# EAGLE design sensor-mega169a (EAGLE 6.4)
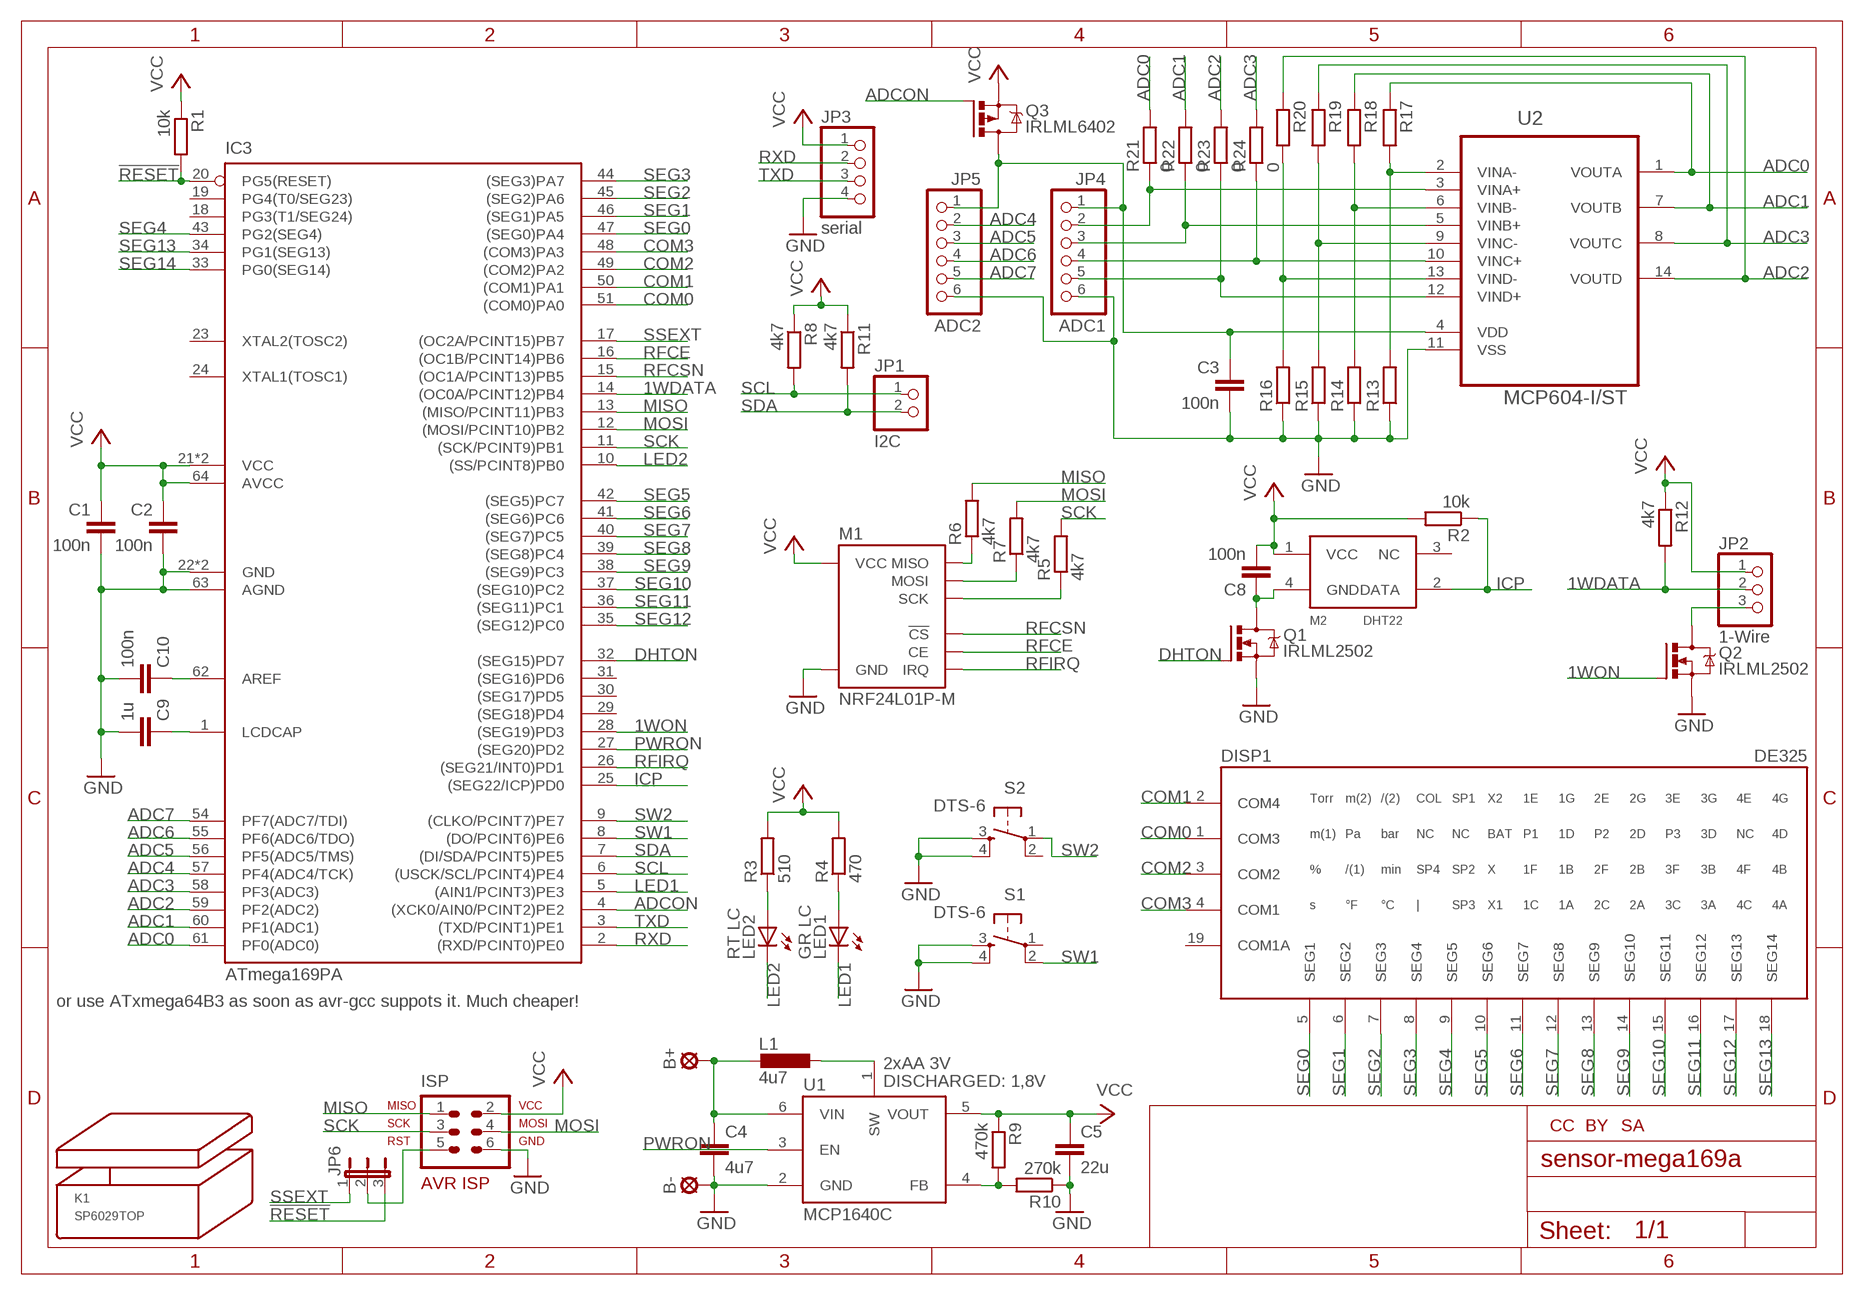
[diagram p0: schematic, sheet 1]

## Parts
B+  LSP11  [LSP11]
B-  LSP11  [LSP11]
C1  100n  C-EUC0603  [C0603]
C2  100n  C-EUC0603  [C0603]
C3  100n  C-EUC0603  [C0603]
C4  4u7  C-EUC0805  [C0805]
C5  22u  C-EUC1206  [C1206]
C8  100n  C-EUC0603  [C0603]
C9  1u  C-EUC0603  [C0603]
C10  100n  C-EUC0603  [C0603]
DISP1  DE325  [DE325]
IC3  ATmega169PA  MEGA169-A  [TQFP64]
ISP  ML6  AVR-ISP-6VERT  [AVR-ISP-6]
JP1  I2C  PINHD-1X2_2.54  [1X02]
JP2  1-Wire  PINHD-1X3_2.54  [1X03]
JP3  serial  PINHD-1X4_2.54  [1X04]
JP4  ADC1  PINHD-1X6_2.54  [1X06]
JP5  ADC2  PINHD-1X6_2.54  [1X06]
JP6  JP2E  [JP2]
K1  SP6029TOP  [SP6029T]
L1  4u7  L-EUPISG  [PISG]
LED1  GR LC  LED5MM  [LED5MM]
LED2  RT LC  LED5MM  [LED5MM]
M1  NRF24L01P-M  [NRF24L01P-A]
M2  DHT22  [DHT22]
Q1  IRLML2502  [MICRO3]
Q2  IRLML2502  [MICRO3]
Q3  IRLML6402  [MICRO3]
R1  10k  R-EU_R0603  [R0603]
R2  10k  R-EU_R0603  [R0603]
R3  510  R-EU_R0805  [R0805]
R4  470  R-EU_R0805  [R0805]
R5  4k7  R-EU_R0603  [R0603]
R6  4k7  R-EU_R0603  [R0603]
R7  4k7  R-EU_R0603  [R0603]
R8  4k7  R-EU_R0603  [R0603]
R9  470k  R-EU_R0603  [R0603]
R10  270k  R-EU_R0603  [R0603]
R11  4k7  R-EU_R0603  [R0603]
R12  4k7  R-EU_R0603  [R0603]
R13  R-EU_R0603  [R0603]
R14  R-EU_R0603  [R0603]
R15  R-EU_R0603  [R0603]
R16  R-EU_R0603  [R0603]
R17  R-EU_R0603  [R0603]
R18  R-EU_R0603  [R0603]
R19  R-EU_R0603  [R0603]
R20  R-EU_R0603  [R0603]
R21  0  R-EU_R0201  [R0201]
R22  0  R-EU_R0201  [R0201]
R23  0  R-EU_R0201  [R0201]
R24  0  R-EU_R0201  [R0201]
S1  DTS-6  [DTS-6]
S2  DTS-6  [DTS-6]
U1  MCP1640C  MCP1640  [SOT23-6]
U2  MCP604-I/ST  [SOP65P640X120-14N]
U$1  CC-TPLACE-HALF  [CC_TPLACE_HS]
U$3  BY-TPLACE-HS  [BY_TPLACE_HS]
U$4  SA-TPLACE-HALF  [SA_TPLACE_HS]

## Nets
1WDATA: IC3.14((OC0A/PCINT12)PB4) JP2.2 R12.2
1WON: IC3.28((SEG19)PD3) Q2.1(G)
!RESET: IC3.20(PG5(RESET)) JP6.3 R1.2
ADC0: IC3.61(PF0(ADC0)) R17.1 R21.2 U2.1(VOUTA)
ADC1: IC3.60(PF1(ADC1)) R18.1 R22.2 U2.7(VOUTB)
ADC2: IC3.59(PF2(ADC2)) R20.1 R23.2 U2.14(VOUTD)
ADC3: IC3.58(PF3(ADC3)) R19.1 R24.2 U2.8(VOUTC)
ADC4: IC3.57(PF4(ADC4/TCK)) JP5.2
ADC5: IC3.56(PF5(ADC5/TMS)) JP5.3
ADC6: IC3.55(PF6(ADC6/TDO)) JP5.4
ADC7: IC3.54(PF7(ADC7/TDI)) JP5.5
ADCON: IC3.4((XCK0/AIN0/PCINT2)PE2) Q3.1(G)
AREF: C10.1 IC3.62(AREF)
COM0: DISP1.1(COM3) IC3.51((COM0)PA0)
COM1: DISP1.2(COM4) IC3.50((COM1)PA1)
COM2: DISP1.3(COM2) IC3.49((COM2)PA2)
COM3: DISP1.4(COM1) IC3.48((COM3)PA3)
DHTON: IC3.32((SEG15)PD7) Q1.1(G)
GND: B-.MP C1.2 C2.2 C3.2 C4.2 C5.2 C9.2 C10.2 IC3.22(GND) IC3.53(GND) IC3.63(AGND) ISP.6 JP3.4 JP4.6 JP5.6 M1.GND_A(GND) M1.GND_B(GND) Q1.2(S) Q2.2(S) R10.1 R13.1 R14.1 R15.1 R16.1 S1.3 S1.4 S2.3 S2.4 U1.2(GND) U2.11(VSS)
ICP: IC3.25((SEG22/ICP)PD0) M2.2(DATA) R2.1
LCDCAP: C9.1 IC3.1(LCDCAP)
LED1: IC3.5((AIN1/PCINT3)PE3) LED1.K(C)
LED2: IC3.10((SS/PCINT8)PB0) LED2.K(C)
MISO: IC3.13((MISO/PCINT11)PB3) ISP.1 R6.2
MOSI: IC3.12((MOSI/PCINT10)PB2) ISP.4 R7.2
N$1: LED2.A R3.1
N$2: C8.1 M2.4(GND) Q1.3(D)
N$3: M1.MISO R6.1
N$4: M1.MOSI R7.1
N$5: M1.SCK R5.1
N$6: ISP.5 JP6.2
N$7: L1.1 U1.1(SW)
N$8: R9.2 R10.2 U1.4(FB)
N$11: JP2.3 Q2.3(D)
N$13: LED1.A R4.1
N$16: JP4.2 R21.1 U2.3(VINA+)
N$17: C3.1 JP4.1 JP5.1 Q3.3(D) U2.4(VDD)
N$18: R16.2 R20.2 U2.13(VIND-)
N$19: R15.2 R19.2 U2.9(VINC-)
N$20: R14.2 R18.2 U2.6(VINB-)
N$21: R13.2 R17.2 U2.2(VINA-)
N$22: JP4.3 R22.1 U2.5(VINB+)
N$24: JP4.5 R23.1 U2.12(VIND+)
N$27: JP4.4 R24.1 U2.10(VINC+)
PWRON: IC3.27((SEG20)PD2) U1.3(EN)
RFCE: IC3.16((OC1B/PCINT14)PB6) M1.CE
RFCSN: IC3.15((OC1A/PCINT13)PB5) M1.CSN(!CS)
RFIRQ: IC3.26((SEG21/INT0)PD1) M1.IRQ
RXD: IC3.2((RXD/PCINT0)PE0) JP3.2
SCK: IC3.11((SCK/PCINT9)PB1) ISP.3 R5.2
SCL: IC3.6((USCK/SCL/PCINT4)PE4) JP1.1 R8.2
SDA: IC3.7((DI/SDA/PCINT5)PE5) JP1.2 R11.2
SEG0: DISP1.5(SEG1) IC3.47((SEG0)PA4)
SEG1: DISP1.6(SEG2) IC3.46((SEG1)PA5)
SEG2: DISP1.7(SEG3) IC3.45((SEG2)PA6)
SEG3: DISP1.8(SEG4) IC3.44((SEG3)PA7)
SEG4: DISP1.9(SEG5) IC3.43(PG2(SEG4))
SEG5: DISP1.10(SEG6) IC3.42((SEG5)PC7)
SEG6: DISP1.11(SEG7) IC3.41((SEG6)PC6)
SEG7: DISP1.12(SEG8) IC3.40((SEG7)PC5)
SEG8: DISP1.13(SEG9) IC3.39((SEG8)PC4)
SEG9: DISP1.14(SEG10) IC3.38((SEG9)PC3)
SEG10: DISP1.15(SEG11) IC3.37((SEG10)PC2)
SEG11: DISP1.16(SEG12) IC3.36((SEG11)PC1)
SEG12: DISP1.17(SEG13) IC3.35((SEG12)PC0)
SEG13: DISP1.18(SEG14) IC3.34(PG1(SEG13))
SEG14: IC3.33(PG0(SEG14))
SSEXT: IC3.17((OC2A/PCINT15)PB7) JP6.1
SW1: IC3.8((DO/PCINT6)PE6) S1.2
SW2: IC3.9((CLKO/PCINT7)PE7) S2.1
TXD: IC3.3((TXD/PCINT1)PE1) JP3.3
VBAT: B+.MP C4.1 L1.2 U1.6(VIN)
VCC: C1.1 C2.1 C5.1 C8.2 IC3.21(VCC) IC3.52(VCC) IC3.64(AVCC) ISP.2 JP2.1 JP3.1 M1.VCC_A(VCC) M1.VCC_B(VCC) M2.1(VCC) Q3.2(S) R1.1 R2.2 R3.2 R4.2 R8.1 R9.1 R11.1 R12.1 U1.5(VOUT)
Unconnected: DISP1.19(COM1A) IC3.18(PG3(T1/SEG24)) IC3.19(PG4(T0/SEG23)) IC3.23(XTAL2(TOSC2)) IC3.24(XTAL1(TOSC1)) IC3.29((SEG18)PD4) IC3.30((SEG17)PD5) IC3.31((SEG16)PD6) M2.3(NC) S1.1 S2.2

## Notes on the sheet
- or use ATxmega64B3 as soon as avr-gcc suppots it. Much cheaper!
- 2xAA 3V
- DISCHARGED: 1,8V

## Library data of the parts
B+ B- = solpad:LSP11: SOLDER PAD drill 1.1 mm
C1-C3 C8-C10 = rcl:C-EU: CAPACITOR, European symbol
C4 = rcl:C-EU: CAPACITOR, European symbol; _REICHELT_: X7R-G0805 4,7/16
C5 = rcl:C-EU: CAPACITOR, European symbol; _REICHELT_: X7R-G1206 22/10
DISP1 = lcd_displays:DE325: Display Elektronik GmbH DE325-Series Datasheet: http://display-elektronik.de/DE325-RS-20_843V.PDF
IC3 = avr-7:MEGA169: MICROCONTROLLER 16 Kbytes FLASH 1 Kbytes SRAM 512 bytes EEPROM USART 8-channel 10 bit ADC 4x25 Segment LCD Driver
ISP = avr-7:AVR-ISP-6: AVR ISP-6 Serial Programming Header
JP1 = pinhead-mod:PINHD-1X2: PIN HEADER
JP2 = pinhead-mod:PINHD-1X3: PIN HEADER
JP3 = pinhead-mod:PINHD-1X4: PIN HEADER
JP4 JP5 = pinhead-mod:PINHD-1X6: PIN HEADER
JP6 = jumper:JP2E: JUMPER
K1 = strapubox:SP6029: Gehäuse Strapubox Typ 6029 Montage Deckel max. Bauteilhöhe, top-layer: 7,5 mm max. Bauteilhöhe, bottom-layer: 10 mm (Dicke der LP: 1,5 mm) Montage Boden max. Bauteilhöhe, top-layer: 12,5 mm max. Bauteilhöhe, bottom-layer: 5 mm (Dicke der LP: 1,5 mm) Außenmaße: Länge: 80 mm Breite: 61 mm Höhe: 23 mm Innenmaße: Länge: 75 mm Breite: 56 mm Höhe: 19 mm Mit Batteriefach 2xAA/9V
L1 = inductor-Fastron:L-EU; _REICHELT_: L-PISG 4,7µ
LED1 = led:LED: LED OSRAM: - CHIPLED LG R971, LG N971, LY N971, LG Q971, LY Q971, LO R971, LY R971 LH N974, LH R974 LS Q976, LO Q976, LY Q976 LO Q996 - Hyper CHIPLED LW Q18S LB Q993, LB Q99A, LB R99A - SideLED LS A670, LO A670, LY A670, LG A670, LP A670 LB A673, LV A673, LT A673, LW A673 LH A674 LY A675 LS A676, LA A676, LO A676, LY A676, LW A676 LS A679, LY A679, LG A679 - Hyper Micro SIDELED® LS Y876, LA Y876, LO Y876, LY Y876 LT Y87S - SmartLED LW L88C, LW L88S LB L89C, LB L89S, LG L890 LS L89K, LO L89K, LY L89K LS L896, LA L896, LO L896, LY L896 - TOPLED LS T670, LO T670, LY T670, LG T670, LP T670 LSG T670, LSP T670, LSY T670, LOP T670, LYG T670 LG T671, LOG T671, LSG T671 LB T673, LV T673, LT T673, LW T673 LH T674 LS T676, LA T676, LO T676, LY T676, LB T676, LH T676, LSB T676, LW T676 LB T67C, LV T67C, LT T67C, LS T67K, LO T67K, LY T67K, LW E67C LS E67B, LA E67B, LO E67B, LY E67B, LB E67C, LV E67C, LT E67C LW T67C LS T679, LY T679, LG T679 LS T770, LO T770, LY T770, LG T770, LP T770 LB T773, LV T773, LT T773, LW T773 LH T774 LS E675, LA E675, LY E675, LS T675 LS T776, LA T776, LO T776, LY T776, LB T776 LHGB T686 LT T68C, LB T68C - Hyper Mini TOPLED® LB M676 - Mini TOPLED Santana® LG M470 LS M47K, LO M47K, LY M47K Source: http://www.osram.convergy.de LUXEON: - LUMILED® LXK2-PW12-R00, LXK2-PW12-S00, LXK2-PW14-U00, LXK2-PW14-V00 LXK2-PM12-R00, LXK2-PM12-S00, LXK2-PM14-U00 LXK2-PE12-Q00, LXK2-PE12-R00, LXK2-PE12-S00, LXK2-PE14-T00, LXK2-PE14-U00 LXK2-PB12-K00, LXK2-PB12-L00, LXK2-PB12-M00, LXK2-PB14-N00, LXK2-PB14-P00, LXK2-PB14-Q00 LXK2-PR12-L00, LXK2-PR12-M00, LXK2-PR14-Q00, LXK2-PR14-R00 LXK2-PD12-Q00, LXK2-PD12-R00, LXK2-PD12-S00 LXK2-PH12-R00, LXK2-PH12-S00 LXK2-PL12-P00, LXK2-PL12-Q00, LXK2-PL12-R00 Source: www.luxeon.com KINGBRIGHT: KA-3528ASYC Source: www.kingbright.com; I: 2.2mA; U_F: 2V2
LED2 = led:LED: LED OSRAM: - CHIPLED LG R971, LG N971, LY N971, LG Q971, LY Q971, LO R971, LY R971 LH N974, LH R974 LS Q976, LO Q976, LY Q976 LO Q996 - Hyper CHIPLED LW Q18S LB Q993, LB Q99A, LB R99A - SideLED LS A670, LO A670, LY A670, LG A670, LP A670 LB A673, LV A673, LT A673, LW A673 LH A674 LY A675 LS A676, LA A676, LO A676, LY A676, LW A676 LS A679, LY A679, LG A679 - Hyper Micro SIDELED® LS Y876, LA Y876, LO Y876, LY Y876 LT Y87S - SmartLED LW L88C, LW L88S LB L89C, LB L89S, LG L890 LS L89K, LO L89K, LY L89K LS L896, LA L896, LO L896, LY L896 - TOPLED LS T670, LO T670, LY T670, LG T670, LP T670 LSG T670, LSP T670, LSY T670, LOP T670, LYG T670 LG T671, LOG T671, LSG T671 LB T673, LV T673, LT T673, LW T673 LH T674 LS T676, LA T676, LO T676, LY T676, LB T676, LH T676, LSB T676, LW T676 LB T67C, LV T67C, LT T67C, LS T67K, LO T67K, LY T67K, LW E67C LS E67B, LA E67B, LO E67B, LY E67B, LB E67C, LV E67C, LT E67C LW T67C LS T679, LY T679, LG T679 LS T770, LO T770, LY T770, LG T770, LP T770 LB T773, LV T773, LT T773, LW T773 LH T774 LS E675, LA E675, LY E675, LS T675 LS T776, LA T776, LO T776, LY T776, LB T776 LHGB T686 LT T68C, LB T68C - Hyper Mini TOPLED® LB M676 - Mini TOPLED Santana® LG M470 LS M47K, LO M47K, LY M47K Source: http://www.osram.convergy.de LUXEON: - LUMILED® LXK2-PW12-R00, LXK2-PW12-S00, LXK2-PW14-U00, LXK2-PW14-V00 LXK2-PM12-R00, LXK2-PM12-S00, LXK2-PM14-U00 LXK2-PE12-Q00, LXK2-PE12-R00, LXK2-PE12-S00, LXK2-PE14-T00, LXK2-PE14-U00 LXK2-PB12-K00, LXK2-PB12-L00, LXK2-PB12-M00, LXK2-PB14-N00, LXK2-PB14-P00, LXK2-PB14-Q00 LXK2-PR12-L00, LXK2-PR12-M00, LXK2-PR14-Q00, LXK2-PR14-R00 LXK2-PD12-Q00, LXK2-PD12-R00, LXK2-PD12-S00 LXK2-PH12-R00, LXK2-PH12-S00 LXK2-PL12-P00, LXK2-PL12-Q00, LXK2-PL12-R00 Source: www.luxeon.com KINGBRIGHT: KA-3528ASYC Source: www.kingbright.com; I: 2mA; U_F: 2V
M1 = modules:NRF24L01P-M
M2 = modules:DHT22
Q1 Q2 = mosfet:IRLML2502: HEXFET N-Channel Power MOSFET http://www.irf.com/product-info/datasheets/data/irlml2502.pdf
Q3 = mosfet:IRLML6402: HEXFET P-Channel Power MOSFET http://www.irf.com/product-info/datasheets/data/irlml6402.pdf
R1-R24 = rcl:R-EU_: RESISTOR, European symbol
S1 S2 = switch-tact:DTS-6
U1 = karlnet-parts:MCP1640: MCP1623, 1624, 1640/B/C/D pwm/pfm or pwm only DC/DC converters, in SOT-23
U2 = microchip:MCP604-I/ST: IC,OPAMP,QUAD; MPN: MCP604-I/ST; OC_FARNELL: 1825060; OC_NEWARK: 12T7762; PACKAGE: TSSOP14; SUPPLIER: Microchip
U$1 = creative-commons:CC: creatice commons - CC
U$3 = creative-commons:BY: creative commons Attribution - BY
U$4 = creative-commons:SA: creative commons ShareAlike - SA

## Board
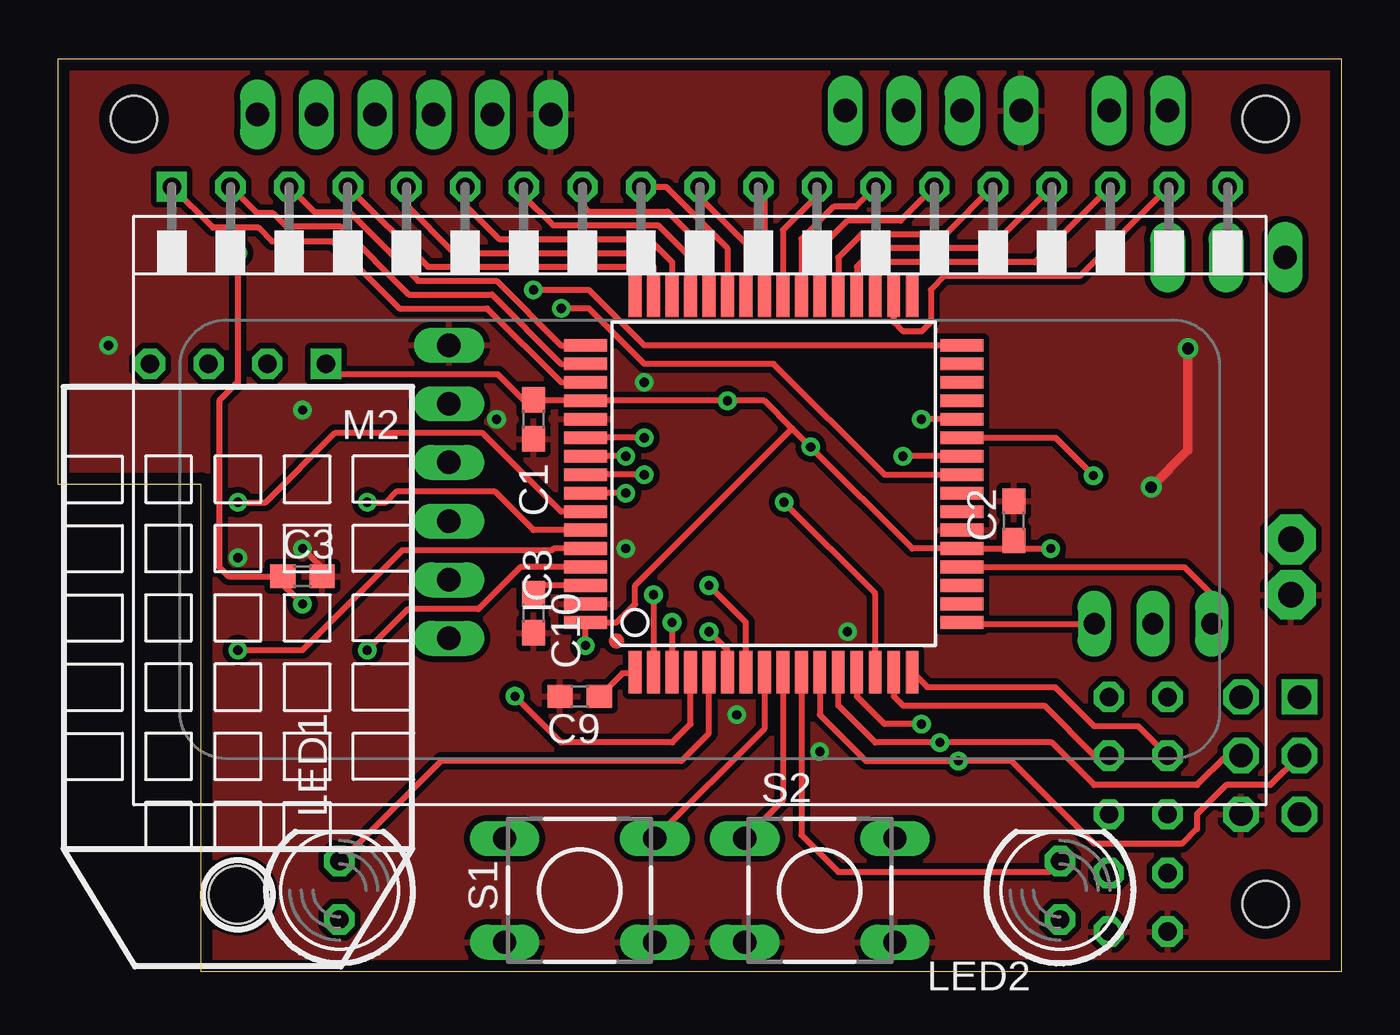
[diagram p1: board, top side]
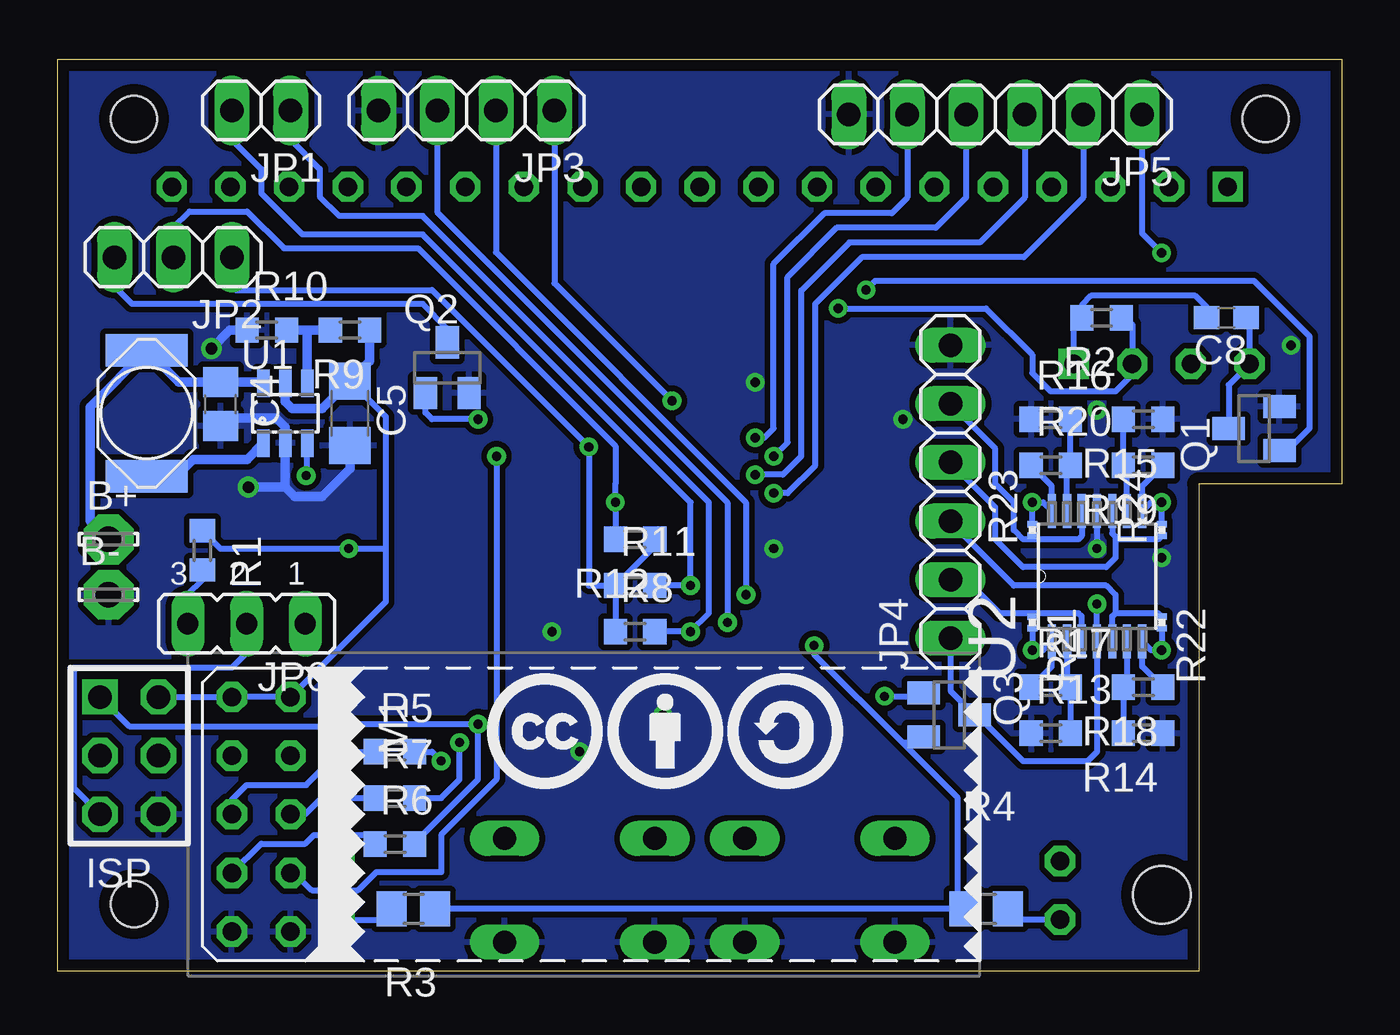
[diagram p2: board, bottom side, seen from below]

Size 55.6 x 39.5 mm. Coordinates in mm from the lower left corner, seen from the top.
Outline: 6.2,21.1 6.2,0 55.6,0 55.6,39.5 0,39.5 0,21.1 6.2,21.1
Copper layers (1*16): Top 0.035mm / dielectric 1.5mm / Bottom 0.035mm
Design rules "bilex-cust *": minimum track width 10mil, minimum drill 0.4mm, track to track 10mil, track to pad 10mil, pad to pad 10mil, via to via 10mil, smd to smd 10mil, copper to edge 0.5mm, drill to drill 8mil, minimum pad ring 10mil, minimum via ring 8mil, stop-mask expansion 4mil, vias tented up to drill 0mil, thermal gap 10mil
Holes 2 mm at 52.3,2.9 52.3,36.9 3.3,36.9
Holes 2.5 mm at 7.8,3.3
bKeepout: area 24.3,24 to 31.6,31.4; area 26.3,30.9 to 29.3,36.9; area 24.3,32.6 to 31.5,39.8

### Footprints (pad centres in the part's own frame; a part is rotated, then mirrored left to right if it is on the bottom)
LSP11 = drill 1.118 pad 2.159 octagon: MP 0,0
C0603 = smd 1.1 x 1: 1 -0.85,0; 2 0.85,0
C0805 = smd 1.3 x 1.5: 1 -0.95,0; 2 0.95,0
C1206 = smd 1.6 x 1.8: 1 -1.4,0; 2 1.4,0
DE325 = drill 0.8 square: 1 -22.86,1.27 | drill 0.8 octagon: 2 -20.32,1.27; 3 -17.78,1.27; 4 -15.24,1.27; 5 -12.7,1.27; 6 -10.16,1.27; 7 -7.62,1.27; 8 -5.08,1.27; 9 -2.54,1.27; 10 0,1.27; 11 2.54,1.27; 12 5.08,1.27; 13 7.62,1.27; 14 10.16,1.27; 15 12.7,1.27; 16 15.24,1.27; 17 17.78,1.27; 18 20.32,1.27; 19 22.86,1.27
TQFP64 = smd 1.85 x 0.55: 1 -8.15,6; 2 -8.15,5.2; 3 -8.15,4.4; 4 -8.15,3.6; 5 -8.15,2.8; 6 -8.15,2; 7 -8.15,1.2; 8 -8.15,0.4; 9 -8.15,-0.4; 10 -8.15,-1.2; 11 -8.15,-2; 12 -8.15,-2.8; 13 -8.15,-3.6; 14 -8.15,-4.4; 15 -8.15,-5.2; 16 -8.15,-6; 33 8.15,-6; 34 8.15,-5.2; 35 8.15,-4.4; 36 8.15,-3.6; 37 8.15,-2.8; 38 8.15,-2; 39 8.15,-1.2; 40 8.15,-0.4; 41 8.15,0.4; 42 8.15,1.2; 43 8.15,2; 44 8.15,2.8; 45 8.15,3.6; 46 8.15,4.4; 47 8.15,5.2; 48 8.15,6 | smd 0.55 x 1.85: 17 -6,-8.15; 18 -5.2,-8.15; 19 -4.4,-8.15; 20 -3.6,-8.15; 21 -2.8,-8.15; 22 -2,-8.15; 23 -1.2,-8.15; 24 -0.4,-8.15; 25 0.4,-8.15; 26 1.2,-8.15; 27 2,-8.15; 28 2.8,-8.15; 29 3.6,-8.15; 30 4.4,-8.15; 31 5.2,-8.15; 32 6,-8.15; 49 6,8.15; 50 5.2,8.15; 51 4.4,8.15; 52 3.6,8.15; 53 2.8,8.15; 54 2,8.15; 55 1.2,8.15; 56 0.4,8.15; 57 -0.4,8.15; 58 -1.2,8.15; 59 -2,8.15; 60 -2.8,8.15; 61 -3.6,8.15; 62 -4.4,8.15; 63 -5.2,8.15; 64 -6,8.15
AVR-ISP-6 = drill 1.016 square: 1 -2.54,-1.27 | drill 1.016 octagon: 2 -2.54,1.27; 3 0,-1.27; 4 0,1.27; 5 2.54,-1.27; 6 2.54,1.27
1X02 = drill 1.016 long: 1 -1.27,0; 2 1.27,0
1X03 = drill 1.016 long: 1 -2.54,0; 2 0,0; 3 2.54,0
1X04 = drill 1.016 long: 1 -3.81,0; 2 -1.27,0; 3 1.27,0; 4 3.81,0
1X06 = drill 1.016 long: 1 -6.35,0; 2 -3.81,0; 3 -1.27,0; 4 1.27,0; 5 3.81,0; 6 6.35,0
JP2 = drill 0.914 long: 1 -2.54,0; 2 0,0; 3 2.54,0
PISG = smd 1.4 x 3.56: 1 -2.73,0; 2 2.73,0
LED5MM = drill 0.813 octagon: A -1.27,0; K 1.27,0
NRF24L01P-A = drill 0.8 octagon: CE -2.54,-1.27; CSN -2.54,1.27; GND_A 5.08,1.27; GND_B 5.08,-1.27; IRQ 2.54,1.27; MISO 2.54,-1.27; MOSI 0,1.27; SCK 0,-1.27; VCC_A -5.08,1.27; VCC_B -5.08,-1.27
DHT22 = drill 0.8 square: 1 -3.81,0 | drill 0.8 octagon: 2 -1.27,0; 3 1.27,0; 4 3.81,0
MICRO3 = smd 1 x 1.4: 1 -0.95,-1.1; 2 0.95,-1.1; 3 0,1.1
R0603 = smd 1 x 1.1: 1 -0.85,0; 2 0.85,0
R0805 = smd 1.3 x 1.5: 1 -0.95,0; 2 0.95,0
R0201 = smd 0.28 x 0.43: 1 -0.255,0; 2 0.255,0
DTS-6 = drill 1 long: 1 -3.25,2.25; 2 3.25,2.25; 3 -3.25,-2.25; 4 3.25,-2.25
SOT23-6 = smd 0.55 x 1.2: 1 -0.95,-1.3; 2 0,-1.3; 3 0.95,-1.3; 4 0.95,1.3; 5 0,1.3; 6 -0.95,1.3
SOP65P640X120-14N = smd 1.473 x 0.356: 1 -2.819,1.956; 2 -2.819,1.295; 3 -2.819,0.66; 4 -2.819,0; 5 -2.819,-0.66; 6 -2.819,-1.295; 7 -2.819,-1.956; 8 2.819,-1.956; 9 2.819,-1.295; 10 2.819,-0.66; 11 2.819,0; 12 2.819,0.66; 13 2.819,1.295; 14 2.819,1.956

### Placement (x,y rotation side)
B+  53.4,18.7 180 bottom
B-  53.4,16.3 0 bottom
C1  20.6,23.9 270 top
C2  41.4,19.5 90 top
C3  10.6,17.1 0 top
C4  48.54,24.56 270 bottom
C5  42.95,24.16 270 bottom
C8  5,28.3 180 bottom
C9  22.6,11.9 180 top
C10  20.6,15.5 270 top
DISP1  27.8,32.7 0 top
IC3  31,21.1 90 top
ISP  52.5,9.33 270 bottom
JP1  46.79,37.27 180 bottom
JP2  50.6,30.92 180 bottom
JP3  37.9,37.27 180 bottom
JP4  16.95,20.76 90 bottom
JP5  15,37.1 180 bottom
JP6  47.42,15.04 180 bottom
K1  -0.2,-2.1 0 top
L1  51.74,24.16 90 bottom
LED1  12.2,3.5 90 top
LED2  43.4,3.5 90 top
M1  46.79,6.79 270 bottom
M2  7.8,26.3 180 top
Q1  3.8,23.5 90 bottom
Q2  38.73,26.13 0 bottom
Q3  17,11.1 270 bottom
R1  49.33,18.22 270 bottom
R2  10.4,28.3 180 bottom
R3  40.2,2.7 0 bottom
R4  15.4,2.7 180 bottom
R5  41,9.5 0 bottom
R6  41,5.5 0 bottom
R7  41,7.5 0 bottom
R8  30.6,14.7 0 bottom
R9  42.95,27.76 180 bottom
R10  46.54,27.76 0 bottom
R11  30.6,16.7 0 bottom
R12  30.6,18.7 180 bottom
R13  12.6,10.3 0 bottom
R14  8.6,10.3 180 bottom
R15  8.6,23.9 180 bottom
R16  12.6,23.9 0 bottom
R17  12.6,12.3 0 bottom
R18  8.6,12.3 180 bottom
R19  8.6,21.9 180 bottom
R20  12.6,21.9 0 bottom
R21  13.4,15.1 270 bottom
R22  7.8,15.1 270 bottom
R23  13.4,19.1 90 bottom
R24  7.8,19.1 90 bottom
S1  22.6,3.5 0 top
S2  33,3.5 0 top
U1  45.74,24.16 0 bottom
U2  10.6,17.1 90 bottom
U$1  37,7.9 0 bottom
U$3  31.8,7.9 0 bottom
U$4  26.6,7.9 0 bottom

### Tracks (layer width: path | path; a pad name or v marks a point on that pad's centre or on a via)
1WDATA  (via drill 0.4)
  Top 0.254: IC3.14 35.4,16.35 v31.45,20.3
  Bottom 0.254: JP2.2 50.6,32.19 49.89,32.9 47.4,32.9 45.8,31.3 40,31.3 31.45,22.75 31.45,21.1 v31.45,20.3 R12.2
1WON  (via drill 0.4)
  Top 0.254: IC3.28 v37.4,23.9
  Bottom 0.254: v37.4,23.9 39.4,23.9 39.68,24.18 Q2.1
!RESET
  Top 0.254: IC3.20 48.78,17.5 49.96,16.31 JP6.3
  Bottom 0.254: JP6.3 49.96,16.31 49.33,16.95 R1.2
ADC0  (via drill 0.4)
  Top 0.254: IC3.61 20.04,17.5 18.21,15.68 15.18,15.68 v13.4,13.9
  Bottom 0.254: U2.1 12.94,13.9 v13.4,13.9 R21.2 | 12.56,14.4 U2.1 | R17.1 12.56,13.19 U2.1
ADC1  (via drill 0.4)
  Top 0.254: v7.8,13.9 10.6,13.9 14.92,18.22 21.39,18.22 21.47,18.3 IC3.60
  Bottom 0.254: U2.7 8.26,13.9 v7.8,13.9 R22.2 | 8.64,14.4 U2.7 | R18.1 8.64,13.19 U2.7
ADC2  (via drill 0.4)
  Top 0.254: IC3.59 20.6,19.1 18.94,20.76 14.66,20.76 14.2,20.3 v13.4,20.3
  Bottom 0.254: U2.14 12.62,19.92 | U2.14 12.94,20.3 v13.4,20.3 R23.2 | 12.56,19.8 U2.14 | U2.14 12.56,21.01 R20.1
ADC3  (via drill 0.4)
  Top 0.254: IC3.58 21.8,19.9 18.4,23.3 12,23.3 9,20.3 v7.8,20.3
  Bottom 0.254: U2.8 8.58,19.92 | U2.8 8.26,20.3 v7.8,20.3 R24.2 | 8.64,19.8 U2.8 | U2.8 8.64,21.01 R19.1
ADC4  (via drill 0.4)
  Top 0.254: v24.6,20.7 IC3.57
  Bottom 0.254: v24.6,20.7 24,20.7 22.8,21.9 22.8,28.9 20.79,30.92 13.77,30.92 11.19,33.5 JP5.2
ADC5  (via drill 0.4)
  Top 0.254: v25.4,21.5 IC3.56
  Bottom 0.254: v25.4,21.5 24.2,21.5 23.4,22.3 23.4,29.47 21.32,31.55 15.68,31.55 13.73,33.5 JP5.3
ADC6  (via drill 0.4)
  Top 0.254: v24.6,22.3 IC3.55
  Bottom 0.254: v24.6,22.3 24,22.9 24,30.06 21.88,32.19 17.58,32.19 16.27,33.5 JP5.4
ADC7  (via drill 0.4)
  Top 0.254: v25.4,23.1 IC3.54
  Bottom 0.254: v25.4,23.1 25,23.1 24.6,23.5 24.6,30.63 22.41,32.82 19.48,32.82 18.81,33.5 JP5.5
ADCON  (via drill 0.4)
  Top 0.254: IC3.4 27.4,10.7 26.6,9.9 21.8,9.9 v19.8,11.9
  Bottom 0.254: v19.8,11.9 18.25,11.9 Q3.1
AREF
  Top 0.254: IC3.62 20.95,16.7 C10.1
COM0
  Top 0.254: IC3.51 21.8,25.5 18.6,28.7 14.8,28.7 11.9,31.6 9.28,31.6 8.69,32.19 6.72,32.19 DISP1.1
COM1
  Top 0.254: IC3.50 21.8,26.3 18.8,29.3 15.2,29.3 12.27,32.23 9.92,32.23 9.33,32.82 8.62,32.82 DISP1.2
COM2
  Top 0.254: DISP1.3 11.12,32.87 12.63,32.87 15.6,29.9 19,29.9 21.8,27.1 IC3.49
COM3
  Top 0.254: DISP1.4 16.03,30.5 24.8,30.5 25,30.3 IC3.48
DHTON  (via drill 0.4)
  Top 0.254: IC3.32 25.4,27.1 23,29.5 v20.6,29.5
  Bottom 0.254: v20.6,29.5 20.2,29.9 3.8,29.9 1.4,27.5 1.4,23.5 2.35,22.55 Q1.1
GND  (via drill 0.4, 0.5)
  Top 0.254: v10.6,18.3 11.45,17.45 C3.2
  Top 0.406: v47.34,20.96 48.95,22.56 v48.95,26.96
  Bottom 0.254: U2.11 v10.6,18.3
  Bottom 0.406: C4.2 48.2,23.96 46.14,23.96 45.74,23.56 U1.2 45.74,20.96 | 45.74,20.96 45.34,20.56 44.14,20.56 42.95,21.76 C5.2 | 45.74,20.96 v47.34,20.96 | R10.1 48.14,27.76 v48.95,26.96
  other vias: 24.6,18.3 7.8,17.9 10.6,24.3 25.4,25.5 29.4,11.1 33,9.5 34.2,14.7 19,23.9 2.2,27.1
  pour Bottom: -0.3,40.54 56.22,40.54 56.22,-0.83 -0.3,-0.83
  pour Top: -0.93,41.17 56.85,41.17 56.85,-1.47 -0.93,-1.47
ICP  (via drill 0.4)
  Top 0.254: IC3.25 35.8,21.5 31,26.3 25.4,26.3 23,28.7 v21.8,28.7
  Bottom 0.254: R2.1 9.27,28.02 9.07,28.02 M2.2 9.07,25.83 9.8,25.1 12.6,25.1 13.4,25.9 13.4,26.7 15.4,28.7 v21.8,28.7
LCDCAP
  Top 0.254: IC3.1 24.95,12.9 24.45,12.9 C9.1
LED1
  Top 0.254: LED1.K 12.27,4.77 16.6,9.1 27,9.1 28.2,10.3 IC3.5
LED2
  Top 0.254: IC3.10 32.2,5.9 33.8,4.3 42.93,4.3 LED2.K
MISO  (via drill 0.4)
  Top 0.254: IC3.13 34.6,11.9 35.8,10.7 v37.4,10.7
  Bottom 0.254: ISP.1 52.5,10.6 44.25,10.6 44.15,10.7 v37.4,10.7 37.4,8.3 40.15,5.55 R6.2
MOSI  (via drill 0.4)
  Top 0.254: IC3.12 33.8,11.5 35.4,9.9 v38.2,9.9 43.04,9.9 44.88,8.06 49.33,8.06 50.6,9.33 ISP.4
  Bottom 0.254: R7.2 39,7.5 38.2,8.3 v38.2,9.9
N$1
  Bottom 0.254: LED2.A 41.62,2.23 R3.1
N$2
  Bottom 0.254: C8.1 3.99,28.14 M2.4 4.9,25.39 Q1.3
N$3
  Bottom 0.254: M1.MISO 46.79,5.52 44.88,5.52 44.5,5.9 42.25,5.9 R6.1
N$4
  Bottom 0.254: M1.MOSI 44.88,6.79 44.17,7.5 R7.1
N$5
  Bottom 0.254: M1.SCK 48.06,7.43 47.42,8.06 44.84,8.06 43.4,9.5 R5.1
N$6
  Bottom 0.254: JP6.2 47.42,13.78 48.06,13.14 54.92,13.14 54.92,7.93 ISP.5
N$7
  Bottom 0.406: U1.1 47.39,22.16 49.74,22.16 50.47,21.43 L1.1
N$8
  Bottom 0.406: R10.2 44.79,27.76 | 44.79,27.76 R9.2 | U1.4 44.79,27.76
N$11
  Bottom 0.254: JP2.3 53.14,29.65 52.39,28.9 39.8,28.9 38.73,27.83 Q2.3
N$13
  Bottom 0.254: LED1.A 13.98,2.23 R4.1
N$16
  Bottom 0.254: U2.3 11.26,15.36 11.4,15.5 13.4,15.5 | 13.4,15.5 14.81,15.5 16.14,16.83 16.83,16.83 JP4.2 | R21.1 13.4,15.5
N$17  (via drill 0.4)
  Top 0.254: v10.6,15.9 9.4,17.1 C3.1 7.4,17.1 7,17.5 7,24.7 7.8,25.5 v7.8,31.1
  Bottom 0.254: v10.6,15.9 U2.4 10.6,9.5 11,9.1 13.8,9.1 15.8,11.1 Q3.3 16.95,12.14 JP4.1 | JP5.1 8.65,31.95 v7.8,31.1
N$18
  Bottom 0.254: U2.13 11.9,21.75 R20.2 R16.2
N$19
  Bottom 0.254: U2.9 9.31,21.75 R19.2 R15.2
N$20
  Bottom 0.254: U2.6 9.31,12.45 R18.2 R14.2
N$21
  Bottom 0.254: U2.2 11.9,12.45 R17.2 R13.2
N$22
  Bottom 0.254: U2.5 9.94,15.36 9.8,15.5 | 9.8,15.5 9.8,16.3 10.2,16.7 14.2,16.7 16.95,19.45 JP4.3 | R22.1 7.94,15.5 9.8,15.5
N$24
  Bottom 0.254: U2.12 11.26,18.84 11.4,18.7 13.4,18.7 | 13.4,18.7 13.8,18.7 14.2,19.1 14.2,20.3 15,21.1 15,22.62 JP4.5 | R23.1 13.4,18.7
N$27
  Bottom 0.254: U2.10 9.94,18.96 9.8,18.82 9.8,18.7 | 9.8,18.7 9.8,17.9 10.2,17.5 13.8,17.5 15,18.7 15,20.08 JP4.4 | R24.1 7.94,18.7 9.8,18.7
PWRON  (via drill 0.4)
  Top 0.254: IC3.27 43.2,23.1 v44.84,21.46
  Bottom 0.254: v44.84,21.46 44.79,21.51 U1.3
RFCE
  Top 0.254: M1.CE 46.79,10.6 44.88,10.6 43.18,12.3 37.65,12.3 IC3.16
RFCSN
  Top 0.254: IC3.15 36.2,11.9 36.6,11.5 42.71,11.5 44.88,9.33 M1.CSN
RFIRQ  (via drill 0.4)
  Top 0.254: IC3.26 v36.6,22.3
  Bottom 0.254: v36.6,22.3 36.6,8.3 39,5.9 39,4.3 41.8,4.3 42.6,3.5 44.6,3.5 45.35,4.25 M1.IRQ
RXD  (via drill 0.4)
  Top 0.254: v25.8,16.3 IC3.2
  Bottom 0.254: JP3.2 36.63,31.13 25.8,20.3 v25.8,16.3
SCK  (via drill 0.4)
  Top 0.254: IC3.11 33,11.1 35,9.1 v39,9.1 41.3,9.1 44.88,5.52 48.7,5.52 49.33,6.16 49.33,6.79 50.6,8.06 52.5,8.06 ISP.3
  Bottom 0.254: R5.2 39.4,9.5 v39,9.1
SCL  (via drill 0.4)
  Top 0.254: IC3.6 29,13.9 v28.2,14.7
  Bottom 0.254: JP1.1 45.52,36 44.25,34.73 44.25,33.55 43.4,32.7 39.8,32.7 27.4,20.3 27.4,15.5 v28.2,14.7 R8.2
SDA  (via drill 0.4)
  Top 0.254: IC3.7 29.8,15.1 v28.2,16.7
  Bottom 0.254: JP1.2 48.06,36 46.79,34.73 46.79,33.69 45,31.9 39.8,31.9 28.2,20.3 v28.2,16.7 R11.2
SEG0
  Top 0.254: IC3.47 25.8,30.5 25.2,31.1 17.17,31.1 15.1,33.17 DISP1.5
SEG1
  Top 0.254: IC3.46 26.6,30.7 25.6,31.7 19.11,31.7 17.64,33.17 DISP1.6
SEG2
  Top 0.254: IC3.45 27.4,30.9 26,32.3 21.45,32.3 20.18,33.57 DISP1.7
SEG3
  Top 0.254: IC3.44 28.2,31.1 26.4,32.9 22.99,32.9 22.72,33.17 DISP1.8
SEG4
  Top 0.254: DISP1.9 26.33,33.97 29,31.3 IC3.43
SEG5
  Top 0.254: DISP1.10 27.8,33.5 29.8,31.5 IC3.42
SEG6
  Top 0.254: DISP1.11 30.6,33.71 IC3.41
SEG7
  Top 0.254: DISP1.12 32.88,33.57 31.4,32.09 IC3.40
SEG8
  Top 0.254: DISP1.13 34.55,33.1 33.6,33.1 32.2,31.7 IC3.39
SEG9
  Top 0.254: DISP1.14 36.49,32.5 34.2,32.5 33,31.3 IC3.38
SEG10
  Top 0.254: DISP1.15 38.43,31.9 34.8,31.9 33.8,30.9 IC3.37
SEG11
  Top 0.254: DISP1.16 40.37,31.3 35.4,31.3 34.6,30.5 IC3.36
SEG12
  Top 0.254: DISP1.17 42.31,30.7 35.8,30.7 35.4,30.3 IC3.35
SEG13
  Top 0.254: DISP1.18 44.25,30.1 38.4,30.1 37.8,29.5 37.8,28.1 37.4,27.7 36.6,27.7 36.2,28.1 IC3.34
SSEXT
  Top 0.254: IC3.17 39.2,15.04 JP6.1
SW1
  Top 0.254: IC3.8 30.6,10.5 S1.2
SW2
  Top 0.254: IC3.9 31.4,7.4 S2.1
TXD  (via drill 0.4)
  Top 0.254: v26.6,15.1 IC3.3
  Bottom 0.254: JP3.3 39.17,32.87 26.6,20.3 v26.6,15.1
VBAT
  Bottom 0.406: U1.6 46.64,25.51 C4.1 50.36,25.51 L1.2 54.2,24.43 54.2,19.5 B+.MP
VCC  (via drill 0.4)
  Top 0.254: 41.4,18.3 IC3.21 37,18.3 v32.6,22.7 31.8,23.5 | 41.4,18.3 C2.1 | 31.8,23.5 30.6,24.7 v29,24.7 IC3.52 20.65,24.7 C1.1 20.15,24.75 19.06,25.84 12.07,25.84 M2.1 | IC3.64 24.2,15.1 25,15.9 25,16.7 31.8,23.5 | 41.4,18.3 v43,18.3 | IC3.64 22.85,14.95 | v22.85,14.1 IC3.64
  Bottom 0.254: M2.1 11.61,27.94 R2.2 11.25,28.85 10.85,29.25 6.35,29.25 5.85,28.75 C8.2 | JP3.1 34.09,29.79 v29,24.7 | R11.1 R8.1 | R12.1 29.75,18.4 R11.1 | JP2.1 48.06,29.65 47.91,29.5 39.4,29.5 v32.6,22.7 32.6,16.7 R11.1 | ISP.2 M1.VCC_B M1.VCC_A 41.4,15.99 41.4,18.3 | R3.2 R4.2 16.62,2.98 16.62,7.5 19.01,9.89 | C5.1 41.4,24.01 41.4,18.3 | 41.4,18.3 v43,18.3 48.56,18.3 R1.1 | Q3.2 18.1,10 18.21,9.89 19.01,9.89 | v22.85,14.1 22.85,13.72 19.01,9.89
  Bottom 0.406: U1.5 45.74,24.66 45.45,24.36 44.14,24.36 C5.1 42.09,26.41 R9.1
(copper drawn outside any net)
  shapes: Top circle x1